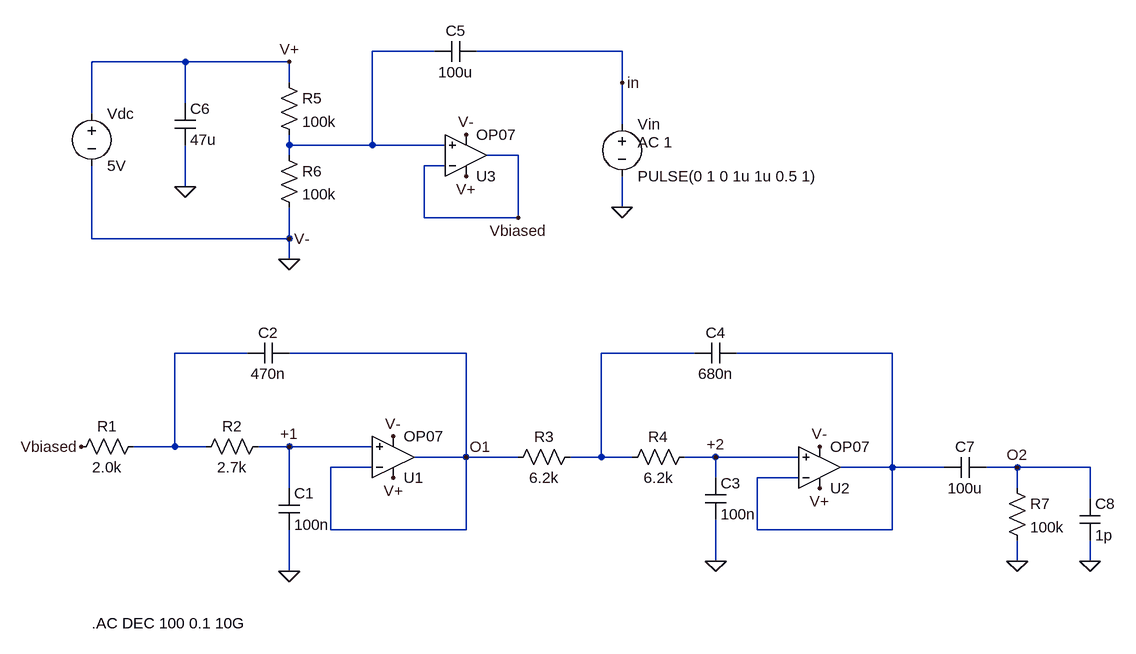
[diagram p0: schematic PWFilter_E24.asc]
PWFilter_E24.asc, the LTspice schematic file:
Version 4
SHEET 1 1340 680
WIRE 256 -416 160 -416
WIRE 544 -416 320 -416
WIRE -128 -400 -272 -400
WIRE 32 -400 -128 -400
WIRE 32 -368 32 -400
WIRE 544 -368 544 -416
WIRE -128 -336 -128 -400
WIRE -272 -320 -272 -400
WIRE 544 -304 544 -368
WIRE 32 -272 32 -288
WIRE 160 -272 160 -416
WIRE 160 -272 32 -272
WIRE 272 -272 160 -272
WIRE 32 -256 32 -272
WIRE 384 -256 336 -256
WIRE 272 -240 240 -240
WIRE -128 -208 -128 -272
WIRE 544 -176 544 -224
WIRE 240 -160 240 -240
WIRE 384 -160 384 -256
WIRE 384 -160 240 -160
WIRE -272 -128 -272 -240
WIRE 32 -128 32 -176
WIRE 32 -128 -272 -128
WIRE 32 -96 32 -128
WIRE -32 48 -144 48
WIRE 304 48 32 48
WIRE 656 48 512 48
WIRE 960 48 720 48
WIRE -144 192 -144 48
WIRE -144 192 -208 192
WIRE -96 192 -144 192
WIRE 32 192 -16 192
WIRE 160 192 32 192
WIRE 304 208 304 48
WIRE 304 208 224 208
WIRE 384 208 304 208
WIRE 512 208 512 48
WIRE 512 208 464 208
WIRE 560 208 512 208
WIRE 688 208 640 208
WIRE 816 208 688 208
WIRE 160 224 96 224
WIRE 960 224 960 48
WIRE 960 224 880 224
WIRE 1040 224 960 224
WIRE 1152 224 1104 224
WIRE 1264 224 1152 224
WIRE 688 240 688 208
WIRE 816 240 752 240
WIRE 32 256 32 192
WIRE 1152 256 1152 224
WIRE 1264 272 1264 224
WIRE 96 320 96 224
WIRE 304 320 304 208
WIRE 304 320 96 320
WIRE 752 320 752 240
WIRE 960 320 960 224
WIRE 960 320 752 320
WIRE 688 368 688 304
WIRE 1152 368 1152 336
WIRE 1264 368 1264 336
WIRE 32 384 32 320
FLAG 32 384 0
FLAG 544 -176 0
FLAG 688 368 0
FLAG 544 -368 in
FLAG 32 192 +1
FLAG 688 208 +2
FLAG 304 208 O1
FLAG 32 -96 0
FLAG 32 -400 V+
FLAG 32 -128 V-
FLAG 192 240 V+
FLAG 848 256 V+
FLAG 192 176 V-
FLAG 848 192 V-
FLAG 304 -288 V-
FLAG 304 -224 V+
FLAG -288 192 Vbiased
FLAG 384 -160 Vbiased
FLAG -128 -208 0
FLAG 1152 368 0
FLAG 1152 224 O2
FLAG 1264 368 0
SYMBOL Opamps\\OP07 192 272 M180
SYMATTR InstName U1
SYMBOL Opamps\\OP07 848 288 M180
SYMATTR InstName U2
SYMBOL res -192 176 R90
WINDOW 0 0 56 VBottom 2
WINDOW 3 32 56 VTop 2
SYMATTR InstName R1
SYMATTR Value 2.0k
SYMBOL res 0 176 R90
WINDOW 0 0 56 VBottom 2
WINDOW 3 32 56 VTop 2
SYMATTR InstName R2
SYMATTR Value 2.7k
SYMBOL res 480 192 R90
WINDOW 0 0 56 VBottom 2
WINDOW 3 32 56 VTop 2
SYMATTR InstName R3
SYMATTR Value 6.2k
SYMBOL cap 16 256 R0
SYMATTR InstName C1
SYMATTR Value 100n
SYMBOL cap 32 32 R90
WINDOW 0 0 32 VBottom 2
WINDOW 3 32 32 VTop 2
SYMATTR InstName C2
SYMATTR Value 470n
SYMBOL voltage 544 -320 R0
WINDOW 123 24 44 Left 2
WINDOW 39 0 0 Left 2
SYMATTR Value2 AC 1
SYMATTR InstName Vin
SYMATTR Value PULSE(0 1 0 1u 1u 0.5 1)
SYMBOL res 656 192 R90
WINDOW 0 0 56 VBottom 2
WINDOW 3 32 56 VTop 2
SYMATTR InstName R4
SYMATTR Value 6.2k
SYMBOL cap 672 240 R0
SYMATTR InstName C3
SYMATTR Value 100n
SYMBOL cap 720 32 R90
WINDOW 0 0 32 VBottom 2
WINDOW 3 32 32 VTop 2
SYMATTR InstName C4
SYMATTR Value 680n
SYMBOL voltage -272 -336 R0
SYMATTR InstName Vdc
SYMATTR Value 5V
SYMBOL res 16 -384 R0
SYMATTR InstName R5
SYMATTR Value 100k
SYMBOL res 16 -272 R0
SYMATTR InstName R6
SYMATTR Value 100k
SYMBOL Opamps\\OP07 304 -192 M180
SYMATTR InstName U3
SYMBOL cap 320 -432 R90
WINDOW 0 0 32 VBottom 2
WINDOW 3 32 32 VTop 2
SYMATTR InstName C5
SYMATTR Value 100u
SYMBOL cap -144 -336 R0
SYMATTR InstName C6
SYMATTR Value 47u
SYMBOL cap 1104 208 R90
WINDOW 0 0 32 VBottom 2
WINDOW 3 32 32 VTop 2
SYMATTR InstName C7
SYMATTR Value 100u
SYMBOL res 1136 240 R0
SYMATTR InstName R7
SYMATTR Value 100k
SYMBOL cap 1248 272 R0
SYMATTR InstName C8
SYMATTR Value 1p
TEXT -272 464 Left 2 !.AC DEC 100 0.1 10G

The netlist it stands for:
* PWFilter_E24.asc
XU1 +1 O1 V+ 0 O1 LT1001  ; OP07, pins In+ In- V+ V- OUT
XU2 +2 N004 V+ 0 N004 LT1001  ; OP07, pins In+ In- V+ V- OUT
R1 N002 Vbiased 2.0k
R2 +1 N002 2.7k
R3 N003 O1 6.2k
C1 +1 0 100n
C2 O1 N002 470n
Vin in 0 PULSE(0 1 0 1u 1u 0.5 1) AC 1
R4 +2 N003 6.2k
C3 +2 0 100n
C4 N004 N003 680n
Vdc V+ 0 5V
R5 V+ N001 100k
R6 N001 0 100k
XU3 N001 Vbiased V+ 0 Vbiased LT1001  ; OP07, pins In+ In- V+ V- OUT
C5 in N001 100u
C6 V+ 0 47u
C7 O2 N004 100u
R7 O2 0 100k
C8 O2 0 1p
.AC DEC 100 0.1 10G
.lib LTC.lib
.backanno
.end